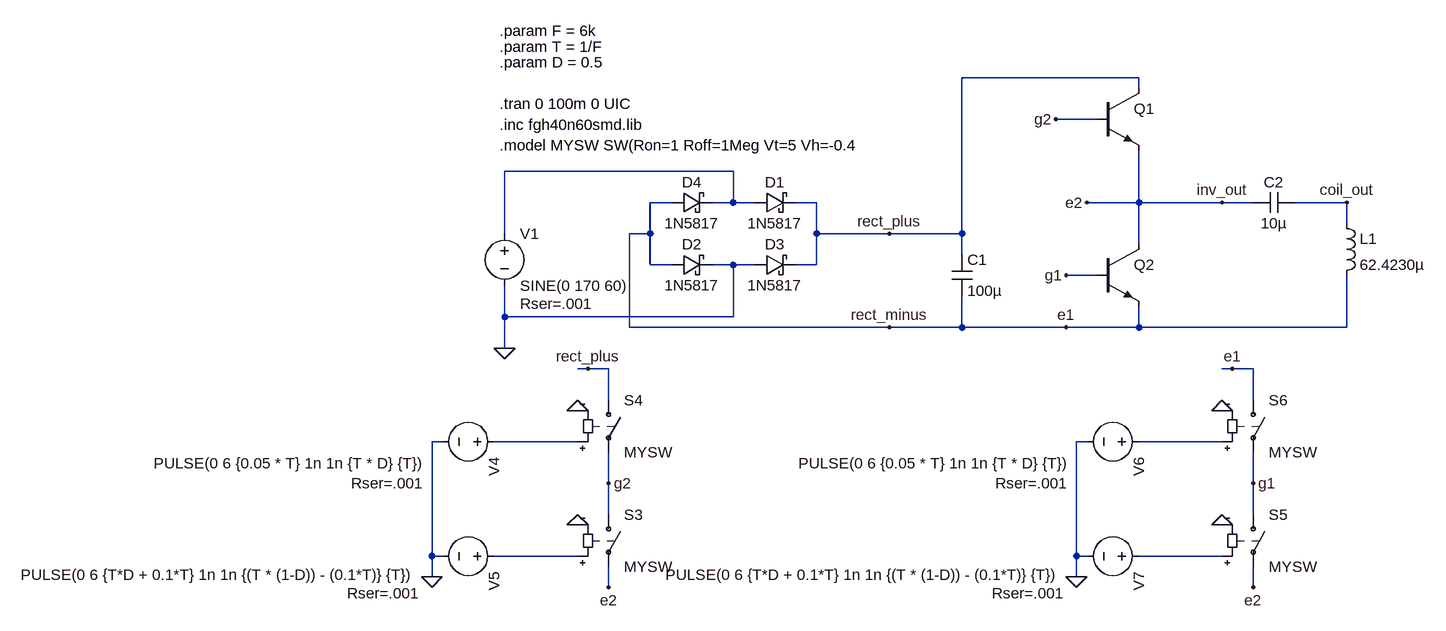
[diagram p0: schematic final_schem_igbt.asc]
final_schem_igbt.asc, the LTspice schematic file:
Version 4.1
SHEET 1 1476 1112
WIRE 1024 -144 752 -144
WIRE 1024 -128 1024 -144
WIRE 960 -80 896 -80
WIRE 400 0 48 0
WIRE 304 48 272 48
WIRE 400 48 400 0
WIRE 400 48 368 48
WIRE 432 48 400 48
WIRE 528 48 496 48
WIRE 1024 48 1024 -32
WIRE 1024 48 944 48
WIRE 1152 48 1024 48
WIRE 1200 48 1152 48
WIRE 1344 48 1264 48
WIRE 1344 80 1344 48
WIRE 48 96 48 0
WIRE 272 96 272 48
WIRE 272 96 240 96
WIRE 528 96 528 48
WIRE 640 96 528 96
WIRE 752 96 752 -144
WIRE 752 96 640 96
WIRE 1024 112 1024 48
WIRE 752 128 752 96
WIRE 272 144 272 96
WIRE 304 144 272 144
WIRE 400 144 368 144
WIRE 432 144 400 144
WIRE 528 144 528 96
WIRE 528 144 496 144
WIRE 960 160 912 160
WIRE 48 224 48 176
WIRE 400 224 400 144
WIRE 400 224 48 224
WIRE 240 240 240 96
WIRE 640 240 240 240
WIRE 752 240 752 192
WIRE 752 240 640 240
WIRE 912 240 752 240
WIRE 1024 240 1024 208
WIRE 1024 240 912 240
WIRE 1344 240 1344 160
WIRE 1344 240 1024 240
WIRE 48 272 48 224
WIRE 176 304 160 304
WIRE 208 304 176 304
WIRE 1168 304 1152 304
WIRE 1200 304 1168 304
WIRE 208 352 208 304
WIRE 1200 352 1200 304
WIRE -48 416 -64 416
WIRE 160 416 32 416
WIRE 944 416 928 416
WIRE 1152 416 1024 416
WIRE 208 480 208 432
WIRE 1200 480 1200 432
WIRE 208 528 208 480
WIRE 1200 528 1200 480
WIRE -64 592 -64 416
WIRE -48 592 -64 592
WIRE 160 592 32 592
WIRE 928 592 928 416
WIRE 944 592 928 592
WIRE 1152 592 1024 592
WIRE -64 624 -64 592
WIRE 928 624 928 592
WIRE 208 640 208 608
WIRE 1200 640 1200 608
FLAG 48 272 0
FLAG 640 96 rect_plus
FLAG 896 -80 g2
FLAG 912 160 g1
FLAG 1152 48 inv_out
FLAG 944 48 e2
FLAG 1344 48 coil_out
FLAG 640 240 rect_minus
FLAG 912 240 e1
FLAG -64 624 0
FLAG 160 544 0
FLAG 160 368 0
FLAG 208 640 e2
FLAG 176 304 rect_plus
FLAG 208 480 g2
FLAG 928 624 0
FLAG 1152 544 0
FLAG 1152 368 0
FLAG 1200 640 e2
FLAG 1168 304 e1
FLAG 1200 480 g1
SYMBOL voltage 48 80 R0
WINDOW 123 0 0 Left 0
WINDOW 39 24 124 Left 2
SYMATTR SpiceLine Rser=.001
SYMATTR InstName V1
SYMATTR Value SINE(0 170 60)
SYMBOL schottky 432 64 R270
WINDOW 0 32 32 VTop 2
WINDOW 3 0 32 VBottom 2
SYMATTR InstName D1
SYMATTR Value 1N5817
SYMATTR Description Diode
SYMATTR Type diode
SYMBOL schottky 304 160 R270
WINDOW 0 32 32 VTop 2
WINDOW 3 0 32 VBottom 2
SYMATTR InstName D2
SYMATTR Value 1N5817
SYMATTR Description Diode
SYMATTR Type diode
SYMBOL schottky 432 160 R270
WINDOW 0 32 32 VTop 2
WINDOW 3 0 32 VBottom 2
SYMATTR InstName D3
SYMATTR Value 1N5817
SYMATTR Description Diode
SYMATTR Type diode
SYMBOL schottky 304 64 R270
WINDOW 0 32 32 VTop 2
WINDOW 3 0 32 VBottom 2
SYMATTR InstName D4
SYMATTR Value 1N5817
SYMATTR Description Diode
SYMATTR Type diode
SYMBOL cap 736 128 R0
SYMATTR InstName C1
SYMATTR Value 100µ
SYMATTR SpiceLine Rser=0
SYMBOL cap 1264 32 R90
WINDOW 0 0 32 VBottom 2
WINDOW 3 32 32 VTop 2
SYMATTR InstName C2
SYMATTR Value 10µ
SYMBOL ind 1328 64 R0
SYMATTR InstName L1
SYMATTR Value 62.4230µ
SYMATTR SpiceLine Rser=7
SYMBOL sw 208 512 R0
SYMATTR InstName S3
SYMATTR Value MYSW
SYMBOL sw 208 336 R0
SYMATTR InstName S4
SYMATTR Value MYSW
SYMBOL sw 1200 512 R0
SYMATTR InstName S5
SYMATTR Value MYSW
SYMBOL sw 1200 336 R0
SYMATTR InstName S6
SYMATTR Value MYSW
SYMBOL voltage 1040 416 R90
WINDOW 3 33 120 VRight 2
WINDOW 123 0 0 Left 0
WINDOW 39 64 124 VRight 2
SYMATTR Value PULSE(0 6 {0.05 * T} 1n 1n {T * D} {T})
SYMATTR SpiceLine Rser=.001
SYMATTR InstName V6
SYMBOL voltage 1040 592 R90
WINDOW 3 29 132 VRight 2
WINDOW 123 0 0 Left 0
WINDOW 39 57 130 VRight 2
SYMATTR Value PULSE(0 6 {T*D + 0.1*T} 1n 1n {(T * (1-D)) - (0.1*T)} {T})
SYMATTR SpiceLine Rser=.001
SYMATTR InstName V7
SYMBOL npn 960 -128 R0
SYMATTR InstName Q1
SYMATTR Value ""
SYMATTR Prefix X
SYMATTR SpiceModel FGH40N60SMD
SYMBOL npn 960 112 R0
SYMATTR InstName Q2
SYMATTR Value ""
SYMATTR Prefix X
SYMATTR SpiceModel FGH40N60SMD
SYMBOL voltage 48 416 R90
WINDOW 3 33 120 VRight 2
WINDOW 123 0 0 Left 0
WINDOW 39 64 124 VRight 2
SYMATTR Value PULSE(0 6 {0.05 * T} 1n 1n {T * D} {T})
SYMATTR SpiceLine Rser=.001
SYMATTR InstName V4
SYMBOL voltage 48 592 R90
WINDOW 3 29 132 VRight 2
WINDOW 123 0 0 Left 0
WINDOW 39 57 130 VRight 2
SYMATTR Value PULSE(0 6 {T*D + 0.1*T} 1n 1n {(T * (1-D)) - (0.1*T)} {T})
SYMATTR SpiceLine Rser=.001
SYMATTR InstName V5
TEXT 40 -72 Left 2 !.inc fgh40n60smd.lib
TEXT 40 -104 Left 2 !.tran 0 100m 0 UIC
TEXT 40 -192 Left 2 !.param T = 1/F
TEXT 40 -216 Left 2 !.param F = 6k
TEXT 40 -168 Left 2 !.param D = 0.5
TEXT 40 -40 Left 2 !.model MYSW SW(Ron=1 Roff=1Meg Vt=5 Vh=-0.4

The netlist it stands for:
* final_schem_igbt.asc
V1 N001 0 SINE(0 170 60) Rser=.001
D1 N001 rect_plus 1N5817
D2 e1 0 1N5817
D3 0 rect_plus 1N5817
D4 e1 N001 1N5817
C1 rect_plus e1 100µ Rser=0
C2 coil_out e2 10µ
L1 coil_out e1 62.4230µ Rser=7
S3 g2 e2 N004 0 MYSW
S4 rect_plus g2 N002 0 MYSW
S5 g1 e2 N005 0 MYSW
S6 e1 g1 N003 0 MYSW
V6 N003 0 PULSE(0 6 {0.05 * T} 1n 1n {T * D} {T}) Rser=.001
V7 N005 0 PULSE(0 6 {T*D + 0.1*T} 1n 1n {(T * (1-D)) - (0.1*T)} {T}) Rser=.001
X§Q1 rect_plus g2 e2 FGH40N60SMD  ; pins C B E
X§Q2 e2 g1 e1 FGH40N60SMD  ; pins C B E
V4 N002 0 PULSE(0 6 {0.05 * T} 1n 1n {T * D} {T}) Rser=.001
V5 N004 0 PULSE(0 6 {T*D + 0.1*T} 1n 1n {(T * (1-D)) - (0.1*T)} {T}) Rser=.001
.model D D
.lib standard.dio
.inc fgh40n60smd.lib
.tran 0 100m 0 UIC
.param T = 1/F
.param F = 6k
.param D = 0.5
.model MYSW SW(Ron=1 Roff=1Meg Vt=5 Vh=-0.4
.backanno
.end